# EAGLE schematic Multimode-VCF-LM13600 (EAGLE 7.6.0)
Single-Supply OTA-Based Multimode VCF http://houshu.at.webry.info/201202/article_1.html
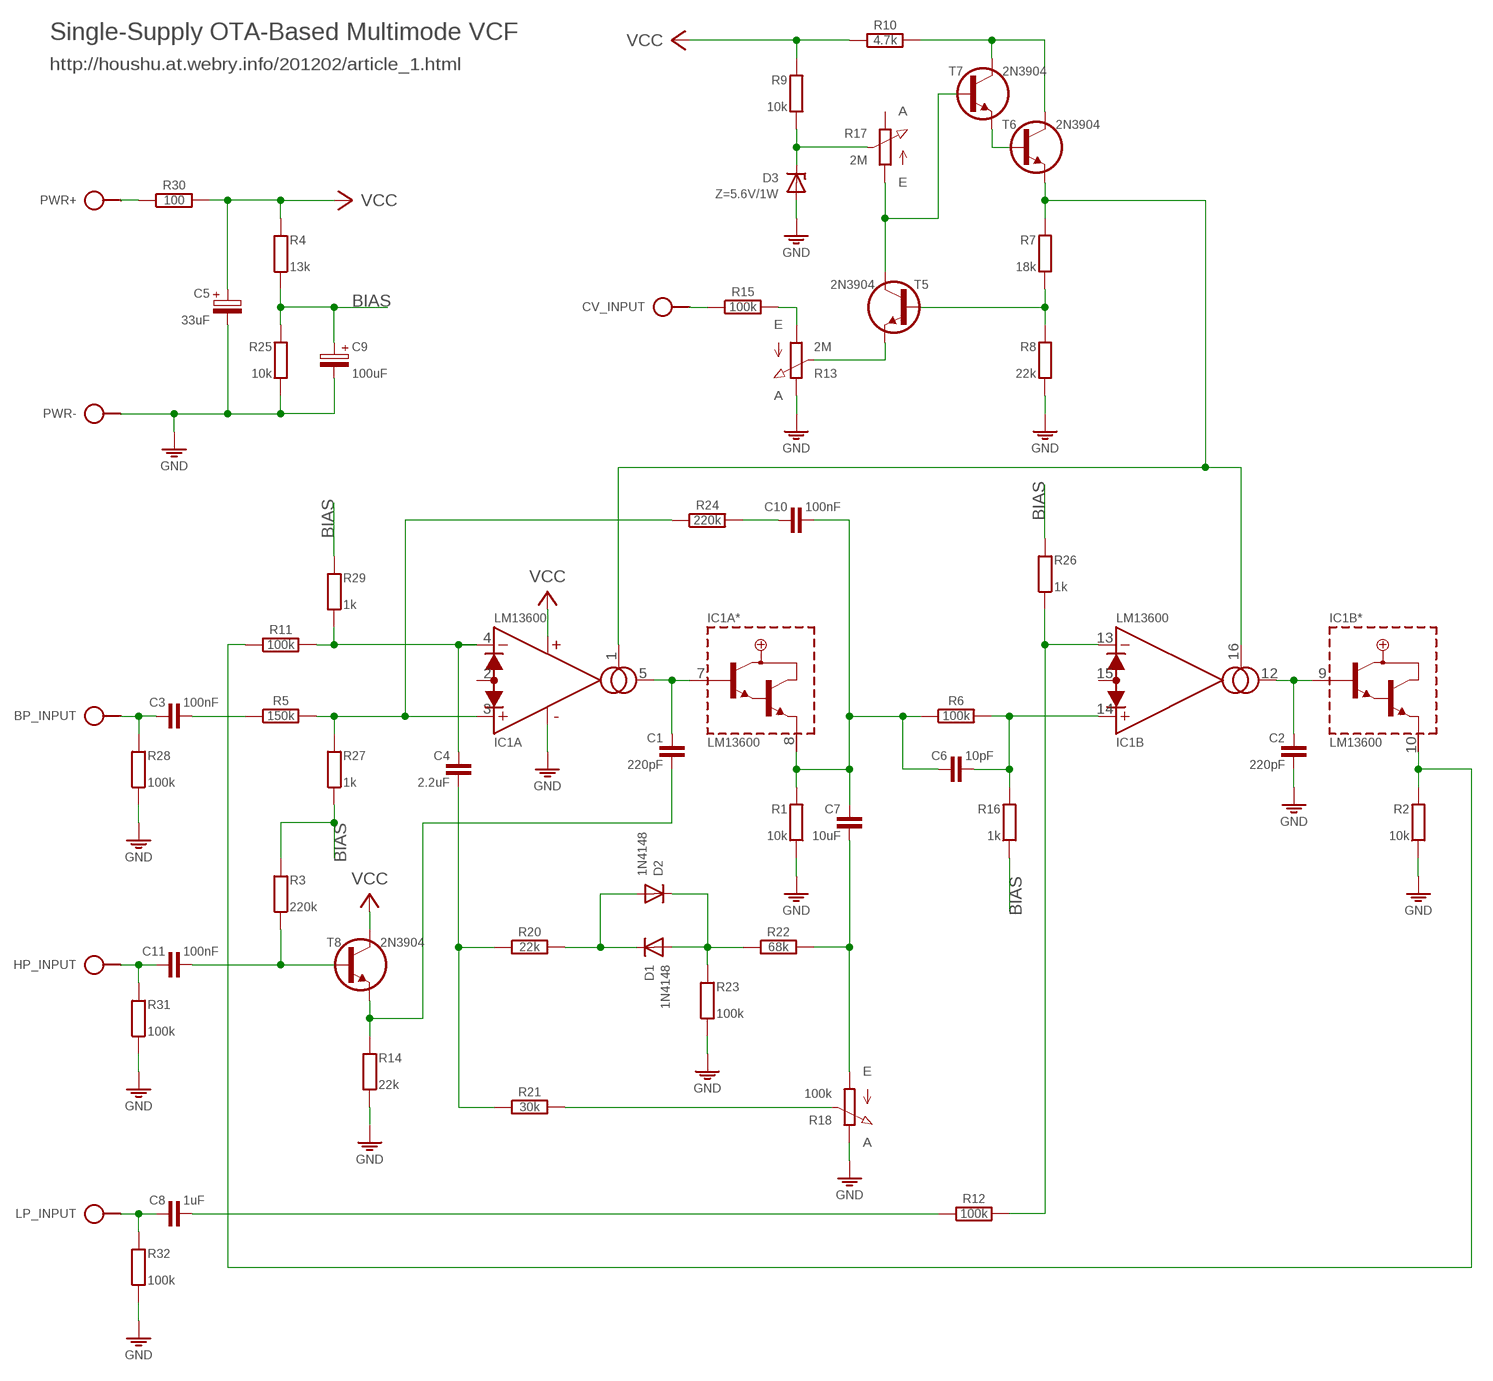
[diagram p0: schematic, sheet 1]

## Parts
BP_INPUT  SPAD  [SPAD]
C1  220pF  C050-020X036/V  [C050-020X036/V]
C2  220pF  C050-020X036/V  [C050-020X036/V]
C3  100nF  C-H050-020X044  [C050-020X044]
C4  2.2uF  C050-024X044/V  [C050-024X044/V]
C5  33uF  CPOLE2,5-4/V  [E2.5-4/V]
C6  10pF  C-H050-020X036  [C050-020X036]
C7  10uF  C050-020X036/V  [C050-020X036/V]
C8  1uF  C-H050-024X044  [C050-024X044]
C9  100uF  CPOLE2,5-4/V  [E2.5-4/V]
C10  100nF  C-H050-020X044  [C050-020X044]
C11  100nF  C-H050-020X044/V  [C050-020X044/V]
CV_INPUT  SPAD  [SPAD]
D1  1N4148  1N414834-2,5-A  [DO34-2,5-A]
D2  1N4148  1N414834-2,5  [DO34-2,5]
D3  Z=5.6V/1W  Z-DIODE-35Z7/V  [DO35Z7/V]
HP_INPUT  SPAD  [SPAD]
IC1  LM13600  [DIL16]
LP_INPUT  SPAD  [SPAD]
PWR  SPAD+--+  [SPAD-+]
R1  10k  R0204/10-V  [0204/10-V]
R2  10k  R0204/10  [0204/10]
R3  220k  R0204/10-V  [0204/10-V]
R4  13k  R0204/10-V  [0204/10-V]
R5  150k  R-H0204/10  [0204/10]
R6  100k  R-H0204/7-V  [0204/7-V]
R7  18k  R0204/10-V  [0204/10-V]
R8  22k  R0204/10-V  [0204/10-V]
R9  10k  R0204/10-V  [0204/10-V]
R10  4.7k  R-H0204/10  [0204/10]
R11  100k  R-H0204/10  [0204/10]
R12  100k  R-H0204/10  [0204/10]
R13  2M  POT-V  [POT-V]
R14  22k  R0204/10-V  [0204/10-V]
R15  100k  R-H0204/10  [0204/10]
R16  1k  R0204/7-V  [0204/7-V]
R17  2M  POT-V  [POT-V]
R18  100k  POT  [POT]
R20  22k  R-H0204/10  [0204/10]
R21  30k  R-H0204/10  [0204/10]
R22  68k  R-H0204/10  [0204/10]
R23  100k  R0204/10-V  [0204/10-V]
R24  220k  R-H0204/10-V  [0204/10-V]
R25  10k  R0204/10-V  [0204/10-V]
R26  1k  R0204/7  [0204/7]
R27  1k  R0204/10-V  [0204/10-V]
R28  100k  R0204/10-V  [0204/10-V]
R29  1k  R0204/10-V  [0204/10-V]
R30  100  R-H0204/10  [0204/10]
R31  100k  R0204/10-V  [0204/10-V]
R32  100k  R0204/10-V  [0204/10-V]
T5  2N3904  [TO92]
T6  2N3904  [TO92]
T7  2N3904  [TO92]
T8  2N3904  [TO92]

## Nets
BIAS: C9.+ R3.1 R4.2 R16.1 R25.1 R26.2 R27.2 R29.1
GND: C2.2 C5.- C9.- D3.A IC1.6(V-) PWR.1 R1.2 R2.1 R8.2 R13.E R14.2 R18.3(E) R23.2 R25.2 R28.2 R31.2 R32.2
N$1: C4.2 R20.1 R21.1
N$2: IC1.3(A:+IN) R5.2 R24.1 R27.1
N$3: C1.2 R14.1 T8.1(E)
N$4: C11.2 R3.2 T8.2(B)
N$5: C1.1 IC1.5(A:OUT) IC1.7(A*:BUFF/IN)
N$6: C6.1 C7.1 C10.2 IC1.8(A*:BUFF/OUT) R1.1 R6.1
N$7: D1.C D2.A R20.2
N$8: D1.A D2.C R22.1 R23.1
N$9: C10.1 R24.2
N$10: C6.2 IC1.14(B:+IN) R6.2 R16.2
N$11: R18.2(S) R21.2
N$12: C7.2 R18.1(A) R22.2
N$13: C4.1 IC1.4(A:-IN) R11.2 R29.2
N$14: IC1.13(B:-IN) R12.2 R26.1
N$15: C8.2 R12.1
N$16: C8.1 LP_INPUT.1 R32.1
N$17: C11.1 HP_INPUT.1 R31.1
N$18: C3.2 R5.1
N$19: BP_INPUT.1 C3.1 R28.1
N$20: C2.1 IC1.9(B*:BUFF/IN) IC1.12(B:OUT)
N$21: IC1.10(B*:BUFF/OUT) R2.2 R11.1
N$22: R17.A T5.3(C) T7.2(B)
N$23: T6.2(B) T7.1(E)
N$24: IC1.1(A:AMP/BIAS) IC1.16(B:AMP/BIAS) R7.1 T6.1(E)
N$25: R7.2 R8.1 T5.2(B)
N$26: D3.C R9.2 R17.S
N$27: R10.2 T6.3(C) T7.3(C)
N$28: R13.S T5.1(E)
N$29: CV_INPUT.1 R15.1
N$30: R13.A R15.2
N$34: PWR.2 R30.1
VCC: C5.+ IC1.11(V+) R4.1 R9.1 R10.1 R30.2 T8.3(C)
Unconnected: IC1.2(A:DIODE/BIAS) IC1.15(B:DIODE/BIAS) R17.E

## Notes on the sheet
- Single-Supply OTA-Based Multimode VCF
- http://houshu.at.webry.info/201202/article_1.html

## Library data of the parts
BP_INPUT CV_INPUT HP_INPUT LP_INPUT = pad:SPAD
C1 C2 C4 C7 = c:C: CAPACITOR, European symbol
C3 C6 C8 C10 C11 = c:C-H
C5 C9 = c:CPOL: POLARIZED CAPACITOR, European symbol
D1 D2 = d:1N4148
D3 = d:Z-DIODE
IC1 = ic:LM13600
PWR = pad:SPAD+-
R1-R4 R7-R9 R14 R16 R23 R25-R29 R31 R32 = r:R: RESISTOR, European symbol
R5 R6 R10-R12 R15 R20-R22 R24 R30 = r:R-H
R13 R17 R18 = r:POT
T5-T8 = t:2N3904